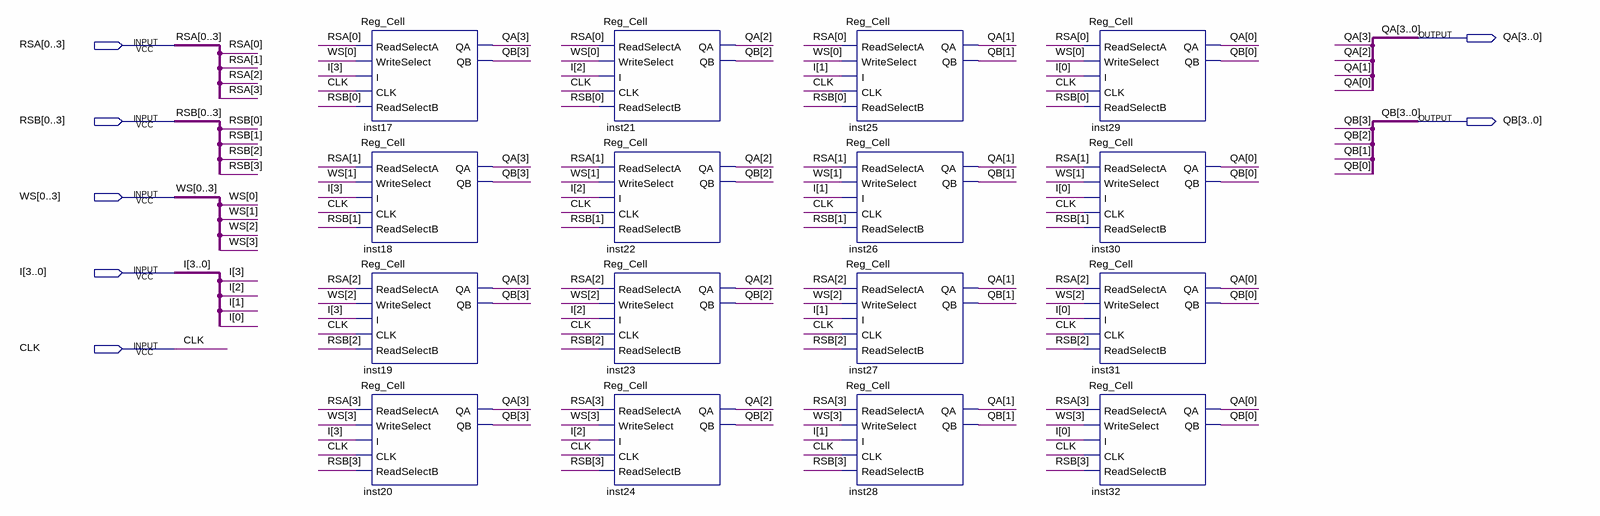
[diagram p0: schematic sheet]
// Quartus schematic Re4x4.bdf as structural Verilog: 16 symbols, 7 pins
module Re4x4 (
  input  [0:3] RSA,
  input  [0:3] RSB,
  input  [0:3] WS,
  input  [3:0] I,
  input  CLK,
  output [3:0] QA,
  output [3:0] QB
);

  Reg_Cell inst17 (
    .ReadSelectA(RSA[0]), .WriteSelect(WS[0]), .I(I[3]), .CLK(CLK), .ReadSelectB(RSB[0]), .QA(QA[3]),
    .QB(QB[3]));
  Reg_Cell inst18 (
    .ReadSelectA(RSA[1]), .WriteSelect(WS[1]), .I(I[3]), .CLK(CLK), .ReadSelectB(RSB[1]), .QA(QA[3]),
    .QB(QB[3]));
  Reg_Cell inst19 (
    .ReadSelectA(RSA[2]), .WriteSelect(WS[2]), .I(I[3]), .CLK(CLK), .ReadSelectB(RSB[2]), .QA(QA[3]),
    .QB(QB[3]));
  Reg_Cell inst20 (
    .ReadSelectA(RSA[3]), .WriteSelect(WS[3]), .I(I[3]), .CLK(CLK), .ReadSelectB(RSB[3]), .QA(QA[3]),
    .QB(QB[3]));
  Reg_Cell inst21 (
    .ReadSelectA(RSA[0]), .WriteSelect(WS[0]), .I(I[2]), .CLK(CLK), .ReadSelectB(RSB[0]), .QA(QA[2]),
    .QB(QB[2]));
  Reg_Cell inst22 (
    .ReadSelectA(RSA[1]), .WriteSelect(WS[1]), .I(I[2]), .CLK(CLK), .ReadSelectB(RSB[1]), .QA(QA[2]),
    .QB(QB[2]));
  Reg_Cell inst23 (
    .ReadSelectA(RSA[2]), .WriteSelect(WS[2]), .I(I[2]), .CLK(CLK), .ReadSelectB(RSB[2]), .QA(QA[2]),
    .QB(QB[2]));
  Reg_Cell inst24 (
    .ReadSelectA(RSA[3]), .WriteSelect(WS[3]), .I(I[2]), .CLK(CLK), .ReadSelectB(RSB[3]), .QA(QA[2]),
    .QB(QB[2]));
  Reg_Cell inst25 (
    .ReadSelectA(RSA[0]), .WriteSelect(WS[0]), .I(I[1]), .CLK(CLK), .ReadSelectB(RSB[0]), .QA(QA[1]),
    .QB(QB[1]));
  Reg_Cell inst26 (
    .ReadSelectA(RSA[1]), .WriteSelect(WS[1]), .I(I[1]), .CLK(CLK), .ReadSelectB(RSB[1]), .QA(QA[1]),
    .QB(QB[1]));
  Reg_Cell inst27 (
    .ReadSelectA(RSA[2]), .WriteSelect(WS[2]), .I(I[1]), .CLK(CLK), .ReadSelectB(RSB[2]), .QA(QA[1]),
    .QB(QB[1]));
  Reg_Cell inst28 (
    .ReadSelectA(RSA[3]), .WriteSelect(WS[3]), .I(I[1]), .CLK(CLK), .ReadSelectB(RSB[3]), .QA(QA[1]),
    .QB(QB[1]));
  Reg_Cell inst29 (
    .ReadSelectA(RSA[0]), .WriteSelect(WS[0]), .I(I[0]), .CLK(CLK), .ReadSelectB(RSB[0]), .QA(QA[0]),
    .QB(QB[0]));
  Reg_Cell inst30 (
    .ReadSelectA(RSA[1]), .WriteSelect(WS[1]), .I(I[0]), .CLK(CLK), .ReadSelectB(RSB[1]), .QA(QA[0]),
    .QB(QB[0]));
  Reg_Cell inst31 (
    .ReadSelectA(RSA[2]), .WriteSelect(WS[2]), .I(I[0]), .CLK(CLK), .ReadSelectB(RSB[2]), .QA(QA[0]),
    .QB(QB[0]));
  Reg_Cell inst32 (
    .ReadSelectA(RSA[3]), .WriteSelect(WS[3]), .I(I[0]), .CLK(CLK), .ReadSelectB(RSB[3]), .QA(QA[0]),
    .QB(QB[0]));
endmodule
